# Altium schematic sheet LED_Array.SchDoc
size 508 x 241 mm
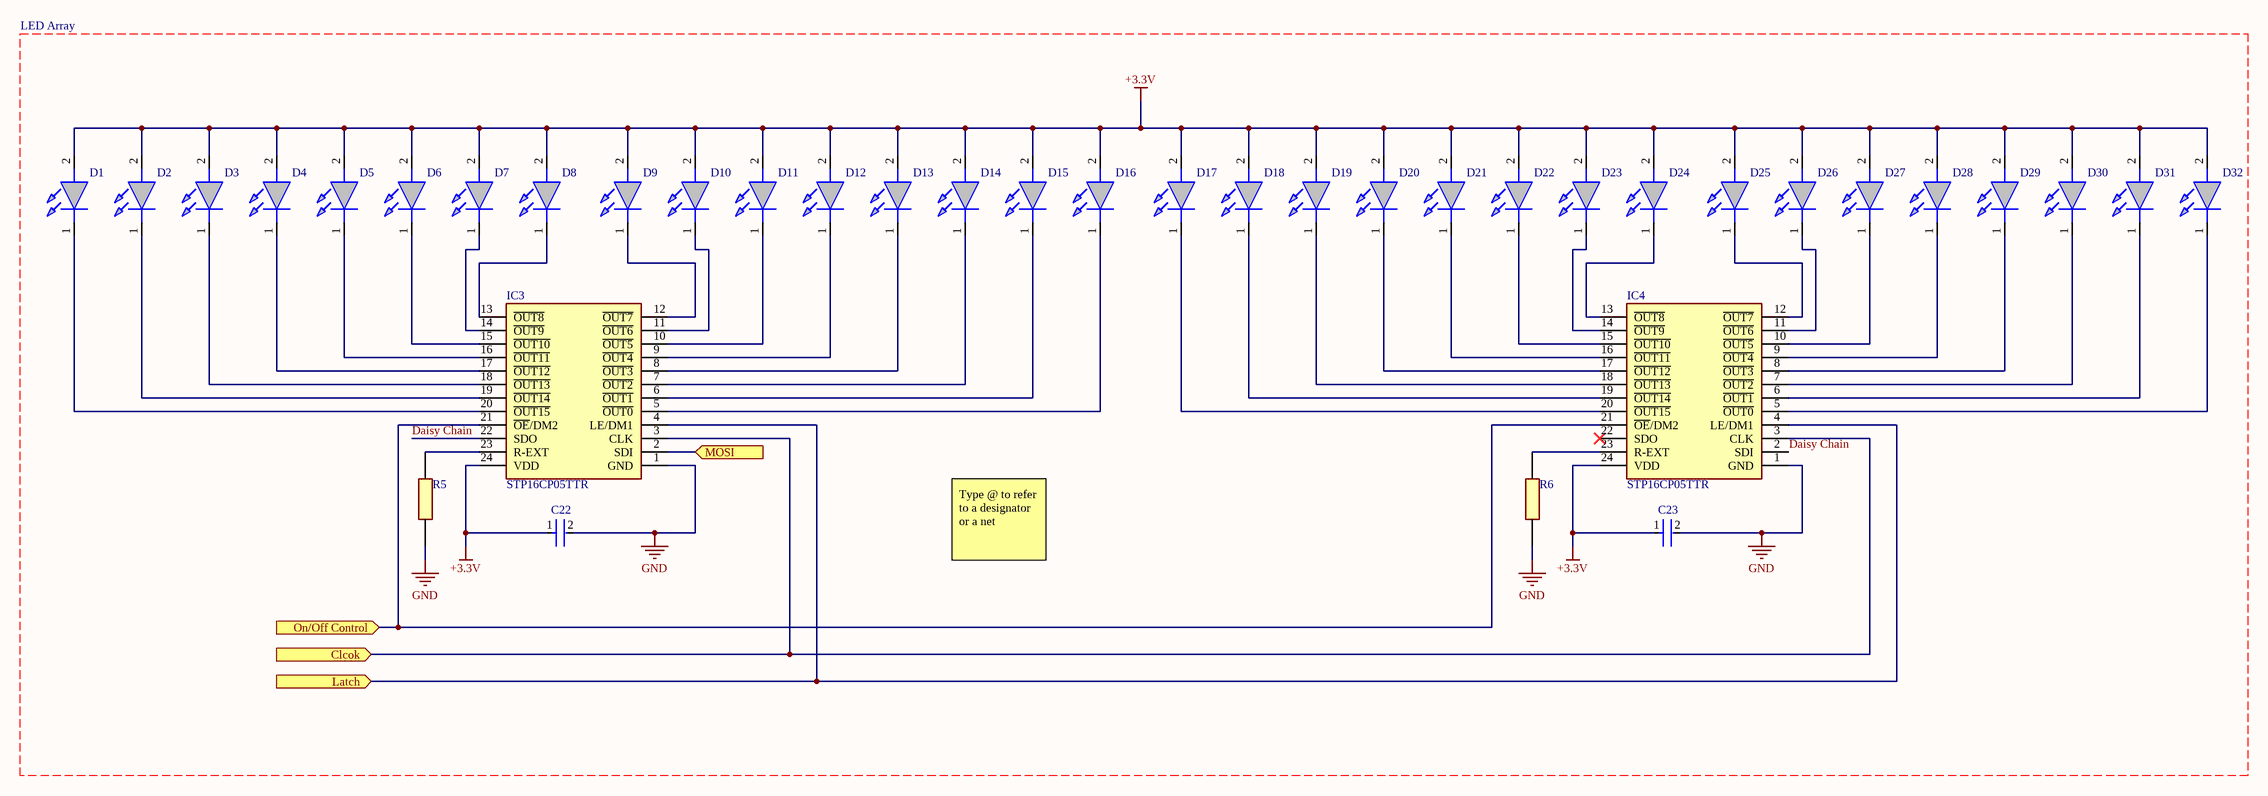
[diagram p0: LED_Array.SchDoc]

## Parts
C22  CL31B104KBP5PNF  [FP-CL31-IPC_C]  (value not drawn)
C23  CL31B104KBP5PNF  [FP-CL31-IPC_C]  (value not drawn)
D1  LR_T64F-BBDB-1-1  [LEDM3528X380N]  (value not drawn)
D2  LR_T64F-BBDB-1-1  [LEDM3528X380N]  (value not drawn)
D3  LR_T64F-BBDB-1-1  [LEDM3528X380N]  (value not drawn)
D4  LR_T64F-BBDB-1-1  [LEDM3528X380N]  (value not drawn)
D5  LR_T64F-BBDB-1-1  [LEDM3528X380N]  (value not drawn)
D6  LR_T64F-BBDB-1-1  [LEDM3528X380N]  (value not drawn)
D7  LR_T64F-BBDB-1-1  [LEDM3528X380N]  (value not drawn)
D8  LR_T64F-BBDB-1-1  [LEDM3528X380N]  (value not drawn)
D9  LR_T64F-BBDB-1-1  [LEDM3528X380N]  (value not drawn)
D10  LR_T64F-BBDB-1-1  [LEDM3528X380N]  (value not drawn)
D11  LR_T64F-BBDB-1-1  [LEDM3528X380N]  (value not drawn)
D12  LR_T64F-BBDB-1-1  [LEDM3528X380N]  (value not drawn)
D13  LR_T64F-BBDB-1-1  [LEDM3528X380N]  (value not drawn)
D14  LR_T64F-BBDB-1-1  [LEDM3528X380N]  (value not drawn)
D15  LR_T64F-BBDB-1-1  [LEDM3528X380N]  (value not drawn)
D16  LR_T64F-BBDB-1-1  [LEDM3528X380N]  (value not drawn)
D17  LR_T64F-BBDB-1-1  [LEDM3528X380N]  (value not drawn)
D18  LR_T64F-BBDB-1-1  [LEDM3528X380N]  (value not drawn)
D19  LR_T64F-BBDB-1-1  [LEDM3528X380N]  (value not drawn)
D20  LR_T64F-BBDB-1-1  [LEDM3528X380N]  (value not drawn)
D21  LR_T64F-BBDB-1-1  [LEDM3528X380N]  (value not drawn)
D22  LR_T64F-BBDB-1-1  [LEDM3528X380N]  (value not drawn)
D23  LR_T64F-BBDB-1-1  [LEDM3528X380N]  (value not drawn)
D24  LR_T64F-BBDB-1-1  [LEDM3528X380N]  (value not drawn)
D25  LR_T64F-BBDB-1-1  [LEDM3528X380N]  (value not drawn)
D26  LR_T64F-BBDB-1-1  [LEDM3528X380N]  (value not drawn)
D27  LR_T64F-BBDB-1-1  [LEDM3528X380N]  (value not drawn)
D28  LR_T64F-BBDB-1-1  [LEDM3528X380N]  (value not drawn)
D29  LR_T64F-BBDB-1-1  [LEDM3528X380N]  (value not drawn)
D30  LR_T64F-BBDB-1-1  [LEDM3528X380N]  (value not drawn)
D31  LR_T64F-BBDB-1-1  [LEDM3528X380N]  (value not drawn)
D32  LR_T64F-BBDB-1-1  [LEDM3528X380N]  (value not drawn)
IC3  STP16CP05TTR  [SOP65P638X110-24N]
IC4  STP16CP05TTR  [SOP65P638X110-24N]
R5  ERA-8APB122V  [RESC3216X70N]  (value not drawn)
R6  ERA-8APB122V  [RESC3216X70N]  (value not drawn)

## Ports
Clcok (in), Latch (in), MOSI (in), On/Off Control (in)

## Nets
+3.3V: C22.1 C23.1 D1.2(A) D2.2(A) D3.2(A) D4.2(A) D5.2(A) D6.2(A) D7.2(A) D8.2(A) D9.2(A) D10.2(A) D11.2(A) D12.2(A) D13.2(A) D14.2(A) D15.2(A) D16.2(A) D17.2(A) D18.2(A) D19.2(A) D20.2(A) D21.2(A) D22.2(A) D23.2(A) D24.2(A) D25.2(A) D26.2(A) D27.2(A) D28.2(A) D29.2(A) D30.2(A) D31.2(A) D32.2(A) IC3.24(VDD) IC4.24(VDD)
GND: C22.2 C23.2 IC3.1(GND) IC4.1(GND) R5.1 R6.1
Clcok: IC3.3(CLK) IC4.3(CLK) ; port Clcok
Daisy Chain: IC3.22(SDO) IC4.2(SDI)
Latch: IC3.4(LE/DM1) IC4.4(LE/DM1) ; port Latch
MOSI: IC3.2(SDI) ; port MOSI
On/Off Control: IC3.21(~{OE}/DM2) IC4.21(~{OE}/DM2) ; port On/Off Control
NetD1_1: D1.1(K) IC3.20(~{OUT15})
NetD2_1: D2.1(K) IC3.19(~{OUT14})
NetD3_1: D3.1(K) IC3.18(~{OUT13})
NetD4_1: D4.1(K) IC3.17(~{OUT12})
NetD5_1: D5.1(K) IC3.16(~{OUT11})
NetD6_1: D6.1(K) IC3.15(~{OUT10})
NetD7_1: D7.1(K) IC3.14(~{OUT9})
NetD8_1: D8.1(K) IC3.13(~{OUT8})
NetD9_1: D9.1(K) IC3.12(~{OUT7})
NetD10_1: D10.1(K) IC3.11(~{OUT6})
NetD11_1: D11.1(K) IC3.10(~{OUT5})
NetD12_1: D12.1(K) IC3.9(~{OUT4})
NetD13_1: D13.1(K) IC3.8(~{OUT3})
NetD14_1: D14.1(K) IC3.7(~{OUT2})
NetD15_1: D15.1(K) IC3.6(~{OUT1})
NetD16_1: D16.1(K) IC3.5(~{OUT0})
NetD17_1: D17.1(K) IC4.20(~{OUT15})
NetD18_1: D18.1(K) IC4.19(~{OUT14})
NetD19_1: D19.1(K) IC4.18(~{OUT13})
NetD20_1: D20.1(K) IC4.17(~{OUT12})
NetD21_1: D21.1(K) IC4.16(~{OUT11})
NetD22_1: D22.1(K) IC4.15(~{OUT10})
NetD23_1: D23.1(K) IC4.14(~{OUT9})
NetD24_1: D24.1(K) IC4.13(~{OUT8})
NetD25_1: D25.1(K) IC4.12(~{OUT7})
NetD26_1: D26.1(K) IC4.11(~{OUT6})
NetD27_1: D27.1(K) IC4.10(~{OUT5})
NetD28_1: D28.1(K) IC4.9(~{OUT4})
NetD29_1: D29.1(K) IC4.8(~{OUT3})
NetD30_1: D30.1(K) IC4.7(~{OUT2})
NetD31_1: D31.1(K) IC4.6(~{OUT1})
NetD32_1: D32.1(K) IC4.5(~{OUT0})
NetIC3_23: IC3.23(R-EXT) R5.2
NetIC4_23: IC4.23(R-EXT) R6.2

Not connected (* = marked no-connect by the designer): IC4 22(SDO)*

## Notes on the sheet
- LED Array
- Type @ to refer to a designator or a net

## Library data of the parts
C22 C23 = CMP-13271-001835-1: Cap Ceramic 100nF 50V X7R ±10% SMD 1206 +125°C Embossed T/R; Capacitance: 100nF; Case Code (Metric): 3216; Case/Package: 1206; Ratings: AEC-Q200; Mount: Surface Mount; Tolerance: 10%; Voltage Rating: 50V; Packaging: Tape and Reel; Max Operating Temperature: 125°C; Min Operating Temperature: -55°C; Case Code (Imperial): 1206; Dielectric: X7R
D1-D32 = LR_T64F-BBDB-1-1: Standard LEDs - SMD Red; Manufacturer_Name: ams OSRAM; Manufacturer_Part_Number: LR T64F-BBDB-1-1; Geometry.Height: 3.8mm; Mouser Part Number: 720-LRT64FBBDB11; Mouser Price/Stock: https://www.mouser.co.uk/ProductDetail/OSRAM-Opto-Semiconductors/LR-T64F-BBDB-1-1/?qs=bPsF1HUXLcPgtbSUB%252BvpOg%3D%3D; Datasheet Link: https://dammedia.osram.info/media/resource/hires/osram-dam-2493734/LR%20T64F.pdf
IC3 IC4 = STP16CP05TTR: STMICROELECTRONICS - STP16CP05TTR - IC LED SINK DRIVER, 16-BIT, LO V; Geometry.Height: 1.1mm; Mouser Part Number: 511-STP16CP05TTR; Mouser Price/Stock: https://www.mouser.co.uk/ProductDetail/STMicroelectronics/STP16CP05TTR?qs=%252BFmDY%2FmH7IYvcBEvWgB%2FVQ%3D%3D; Manufacturer_Name: STMicroelectronics; Manufacturer_Part_Number: STP16CP05TTR; Datasheet Link: http://www.st.com/web/en/resource/technical/document/datasheet/CD00126634.pdf
R5 R6 = ERA-8APB122V: Thin Film Resistors - SMD 1206 Thin film chip resistor; Manufacturer_Name: Panasonic; Geometry.Height: 0.7mm; Mouser Part Number: 667-ERA-8APB122V; Mouser Price/Stock: https://www.mouser.co.uk/ProductDetail/Panasonic/ERA-8APB122V?qs=PgLP5Altfoz8TeGz8FyJXw%3D%3D; Manufacturer_Part_Number: ERA-8APB122V; Datasheet Link: https://industrial.panasonic.com/cdbs/www-data/pdf/RDM0000/AOA0000C307.pdf